# Altium schematic sheet Altium Demo - Smart Edit.SchDoc
size A3; CompanyName: Nevi BATAKLI; Engineer: Nevi BATAKLI; Revision: V1I1; SheetNumber: 1; SheetTotal: 1
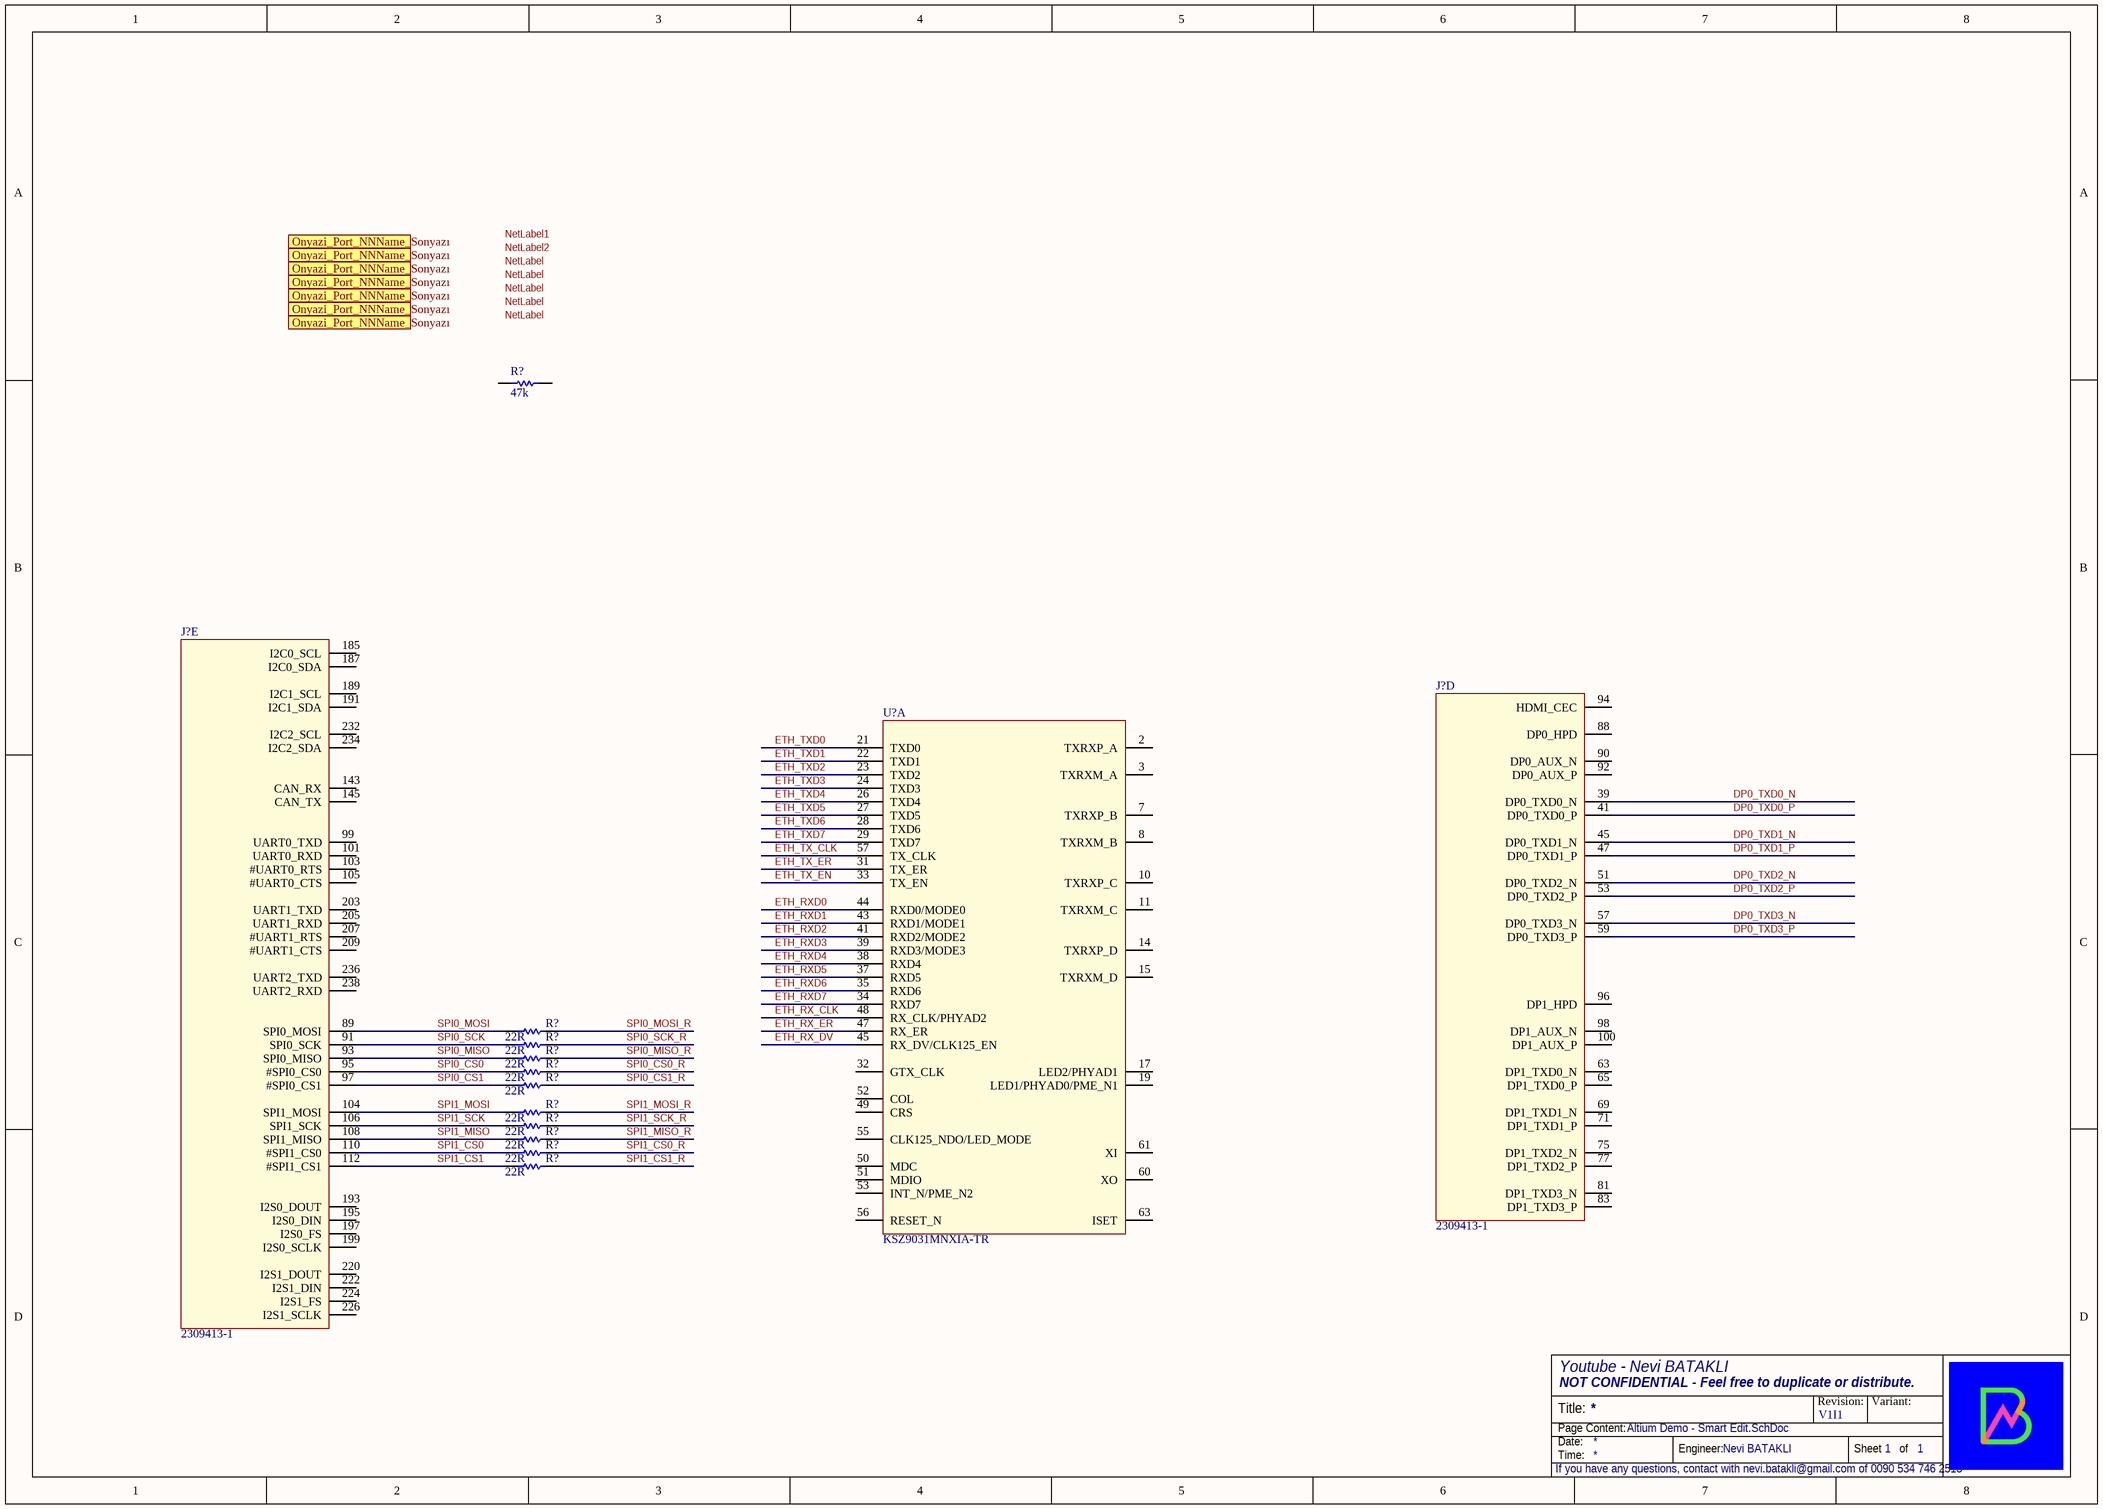
[diagram p0: Altium Demo - Smart Edit.SchDoc]

## Parts
(Parts that share a designator on the sheet are numbered #1, #2 ... from top to bottom, then left to right.)
J?#1  2309413-1  [SODIMM 260P 9.2H STD]  (part E of 8)
J?#2  2309413-1  [SODIMM 260P 9.2H STD]  (part D of 8)
R?#1  47k  [RC0402FR-0747KL]
R?#2  22R  [AC0402FR-0722RL]
R?#3  22R  [AC0402FR-0722RL]
R?#4  22R  [AC0402FR-0722RL]
R?#5  22R  [AC0402FR-0722RL]
R?#6  22R  [AC0402FR-0722RL]
R?#7  22R  [AC0402FR-0722RL]
R?#8  22R  [AC0402FR-0722RL]
R?#9  22R  [AC0402FR-0722RL]
R?#10  22R  [AC0402FR-0722RL]
R?#11  22R  [AC0402FR-0722RL]
U?  KSZ9031MNXIA-TR  (part A of 2)

## Ports
Onyazi_Port_NNName_Sonyazı

## Nets
DP0_TXD0_N: J?#2.39(DP0_TXD0_N)
DP0_TXD0_P: J?#2.41(DP0_TXD0_P)
DP0_TXD1_N: J?#2.45(DP0_TXD1_N)
DP0_TXD1_P: J?#2.47(DP0_TXD1_P)
DP0_TXD2_N: J?#2.51(DP0_TXD2_N)
DP0_TXD2_P: J?#2.53(DP0_TXD2_P)
DP0_TXD3_N: J?#2.57(DP0_TXD3_N)
DP0_TXD3_P: J?#2.59(DP0_TXD3_P)
ETH_RX_CLK: U?.48(RX_CLK/PHYAD2)
ETH_RX_DV: U?.45(RX_DV/CLK125_EN)
ETH_RX_ER: U?.47(RX_ER)
ETH_RXD0: U?.44(RXD0/MODE0)
ETH_RXD1: U?.43(RXD1/MODE1)
ETH_RXD2: U?.41(RXD2/MODE2)
ETH_RXD3: U?.39(RXD3/MODE3)
ETH_RXD4: U?.38(RXD4)
ETH_RXD5: U?.37(RXD5)
ETH_RXD6: U?.35(RXD6)
ETH_RXD7: U?.34(RXD7)
ETH_TX_CLK: U?.57(TX_CLK)
ETH_TX_EN: U?.33(TX_EN)
ETH_TX_ER: U?.31(TX_ER)
ETH_TXD0: U?.21(TXD0)
ETH_TXD1: U?.22(TXD1)
ETH_TXD2: U?.23(TXD2)
ETH_TXD3: U?.24(TXD3)
ETH_TXD4: U?.26(TXD4)
ETH_TXD5: U?.27(TXD5)
ETH_TXD6: U?.28(TXD6)
ETH_TXD7: U?.29(TXD7)
SPI0_CS0: J?#1.95(#SPI0_CS0) R?#5.1
SPI0_CS0_R: R?#5.2
SPI0_CS1: J?#1.97(#SPI0_CS1) R?#6.1
SPI0_CS1_R: R?#6.2
SPI0_MISO: J?#1.93(SPI0_MISO) R?#4.1
SPI0_MISO_R: R?#4.2
SPI0_MOSI: J?#1.89(SPI0_MOSI) R?#2.1
SPI0_MOSI_R: R?#2.2
SPI0_SCK: J?#1.91(SPI0_SCK) R?#3.1
SPI0_SCK_R: R?#3.2
SPI1_CS0: J?#1.110(#SPI1_CS0) R?#10.1
SPI1_CS0_R: R?#10.2
SPI1_CS1: J?#1.112(#SPI1_CS1) R?#11.1
SPI1_CS1_R: R?#11.2
SPI1_MISO: J?#1.108(SPI1_MISO) R?#9.1
SPI1_MISO_R: R?#9.2
SPI1_MOSI: J?#1.104(SPI1_MOSI) R?#7.1
SPI1_MOSI_R: R?#7.2
SPI1_SCK: J?#1.106(SPI1_SCK) R?#8.1
SPI1_SCK_R: R?#8.2

Not connected (* = marked no-connect by the designer): J?#1 99(UART0_TXD) 101(UART0_RXD) 103(#UART0_RTS) 105(#UART0_CTS) 143(CAN_RX) 145(CAN_TX) 185(I2C0_SCL) 187(I2C0_SDA) 189(I2C1_SCL) 191(I2C1_SDA) 193(I2S0_DOUT) 195(I2S0_DIN) 197(I2S0_FS) 199(I2S0_SCLK) 203(UART1_TXD) 205(UART1_RXD) 207(#UART1_RTS) 209(#UART1_CTS) 220(I2S1_DOUT) 222(I2S1_DIN) 224(I2S1_FS) 226(I2S1_SCLK) 232(I2C2_SCL) 234(I2C2_SDA) 236(UART2_TXD) 238(UART2_RXD); J?#2 63(DP1_TXD0_N) 65(DP1_TXD0_P) 69(DP1_TXD1_N) 71(DP1_TXD1_P) 75(DP1_TXD2_N) 77(DP1_TXD2_P) 81(DP1_TXD3_N) 83(DP1_TXD3_P) 88(DP0_HPD) 90(DP0_AUX_N) 92(DP0_AUX_P) 94(HDMI_CEC) 96(DP1_HPD) 98(DP1_AUX_N) 100(DP1_AUX_P); R?#1 1 2; U? 2(TXRXP_A) 3(TXRXM_A) 7(TXRXP_B) 8(TXRXM_B) 10(TXRXP_C) 11(TXRXM_C) 14(TXRXP_D) 15(TXRXM_D) 17(LED2/PHYAD1) 19(LED1/PHYAD0/PME_N1) 32(GTX_CLK) 49(CRS) 50(MDC) 51(MDIO) 52(COL) 53(INT_N/PME_N2) 55(CLK125_NDO/LED_MODE) 56(RESET_N) 60(XO) 61(XI) 63(ISET)

## Notes on the sheet
- Labels drawn without touching a wire or pin: NetLabel, NetLabel1, NetLabel2
- Youtube - Nevi BATAKLI
- NOT CONFIDENTIAL - Feel free to duplicate or distribute.
- Title:
- Page Content:
- Date:
- Time:
- Engineer:
- Revision:
- Sheet
- Variant:
- of
- If you have any questions, contact with nevi.batakli@gmail.com of 0090 534 746 2518

## Library data of the parts
J?#1 J?#2 = 2309413-1: CONN Inline   SMD 260P; Manufacturer: TE Connectivity; .Creator: NB; Number of Contacts: 260; Supplier 1: Digi-Key; RoHS: No; Category: Connectors - Inline Sockets; Stock 1: 11129; Pricing 1: 1=1.97000, 10=1.79000, 25=1.68040, 50=1.60740, 100=1.53430 (USD); Mount: Surface Mount; Contact Material: Copper Alloy; Housing Color: Black; Housing Material: Thermoplastic; Contact Plating: Gold; Min Operating Temperature: -67°C; Max Operating Temperature: 185°C; Packaging: Tape and Reel; Package Quantity: 500; Flammability Rating: UL94 V-0; ComponentLink1URL: https://www.te.com/commerce/DocumentDelivery/DDEController?Action=srchrtrv&DocNm=2309413&DocType=Customer+Drawing&DocLang=English&src-supplier=Digi-Key; ComponentLink1Description: https://www.te.com/commerce/DocumentDelivery/DDEController?Action=srchrtrv&DocNm=2309413&DocType=Customer+Drawing&DocLang=English&src-supplier=Digi-Key; ComponentLink2URL: https://www.te.com/commerce/DocumentDelivery/DDEController?Action=srchrtrv&amp;DocNm=2309413&amp;DocType=Customer+Drawing&amp;DocLang=English&src-supplier=Digi-Key; ComponentLink2Description: https://www.te.com/commerce/DocumentDelivery/DDEController?Action=srchrtrv&amp;DocNm=2309413&amp;DocType=Customer+Drawing&amp;DocLang=English&src-supplier=Digi-Key; Supplier Part Number 1: A126764CT-ND; .PCBChecked: NB; .SCHChecked: NB; Color: Black; Manufacturer Part Number: 2309413-1
R?#1 = RC0402FR-0747KL: RES SMD 47kR     0402  1%   63mW; Manufacturer: Yageo; Voltage Rating: 50V; Temperature Coefficient: 100ppm/°C; .Creator: NB; Sequence: 47; Supplier 1: Digi-Key; Manufacturer Part Number: RC0402FR-0747KL; RoHS: Yes; Category: Resistors - SMD; Pricing 1: 1=0.10000, 10=0.01500, 100=0.00620, 1000=0.00278, 2500=0.00242, 5000=0.00200 (USD); Case/Package: 0402; Min Operating Temperature: -55°C; Max Operating Temperature: 155°C; Tolerance: 1%; Resistance: 47kR; Packaging: Cut Tape; Package Quantity: 10000; Termination: Surface Mount; Composition: Thick Film; Max Power Dissipation: 63mW; Features: Moisture Resistant; ComponentLink1URL: https://datasheet.ciiva.com/16793/pyu-rc0402-51-rohs-l-6-r-16793430.pdf?src-supplier=Future+Electronics; ComponentLink1Description: https://datasheet.ciiva.com/16793/pyu-rc0402-51-rohs-l-6-r-16793430.pdf?src-supplier=Future+Electronics; ComponentLink2URL: https://datasheet.ciiva.com/46412/1018594-46412839.pdf?src-supplier=Element14; ComponentLink2Description: https://datasheet.ciiva.com/46412/1018594-46412839.pdf?src-supplier=Element14; Supplier Part Number 1: 311-47.0KLRCT-ND; .SCHChecked: NB; Stock 1: 3601764
R?#2-R?#11 = AC0402FR-0722RL: RES SMD 22R      0402  1%   63mW; Manufacturer: Yageo; Voltage Rating: 50V; Temperature Coefficient: 100ppm/°C; .Creator: NB; Sequence: 5; Supplier 1: Digi-Key; Manufacturer Part Number: AC0402FR-0722RL; RoHS: Yes; Category: Resistors - SMD; Stock 1: 33827; Pricing 1: 1=0.10000, 10=0.02000, 100=0.00830, 1000=0.00374, 2500=0.00324, 5000=0.00268 (USD); Case/Package: 0402; Min Operating Temperature: -55°C; Max Operating Temperature: 155°C; Packaging: Cut Tape; Resistance: 22R; Tolerance: 1%; Composition: Thick Film; Termination: Surface Mount; Max Power Dissipation: 63mW; Features: Moisture Resistant,Automotive AEC-Q200; ComponentLink1URL: http://www.mouser.com/ds/2/447/yageodocoutput-1111992.pdf?src-supplier=Mouser; ComponentLink1Description: http://www.mouser.com/ds/2/447/yageodocoutput-1111992.pdf?src-supplier=Mouser; ComponentLink2URL: http://www.yageo.com/NewPortal/yageodocoutput?fileName=/pdf/R-Chip/PYu-AC_51_RoHS_L_6.pdf&src-supplier=Digi-Key; ComponentLink2Description: http://www.yageo.com/NewPortal/yageodocoutput?fileName=/pdf/R-Chip/PYu-AC_51_RoHS_L_6.pdf&src-supplier=Digi-Key; Supplier Part Number 1: YAG3460CT-ND; .SCHChecked: NB; Package Quantity: 10000
U? = KSZ9031MNXIA-TR: Ethernet Controller, 1 Gbps, Ieee 802.3, 3.135 V, 3.465 V, Qfn, 64; Manufacturer: Microchip; Supplier 1: Mouser; Manufacturer Part Number: KSZ9031MNXIA-TR; RoHS: Yes; Category: Interface ICs; Stock 1: 754; Pricing 1: 1=5.38000, 10=4.92000, 25=4.10000, 100=3.73000, 250=3.73000, 500=3.73000 (USD); ComponentLink1URL: https://datasheet.ciiva.com/22727/1746924-22727509.pdf?src-supplier=Element14; ComponentLink1Description: https://datasheet.ciiva.com/22727/1746924-22727509.pdf?src-supplier=Element14; ComponentLink2URL: https://datasheet.ciiva.com/16495/ksz9031mnx-16495757.pdf?src-supplier=Future+Electronics; ComponentLink2Description: https://datasheet.ciiva.com/16495/ksz9031mnx-16495757.pdf?src-supplier=Future+Electronics; Supplier Part Number 1: 998-KSZ9031MNXIATR